# EAGLE design max78000_audio (EAGLE 9.6.2)
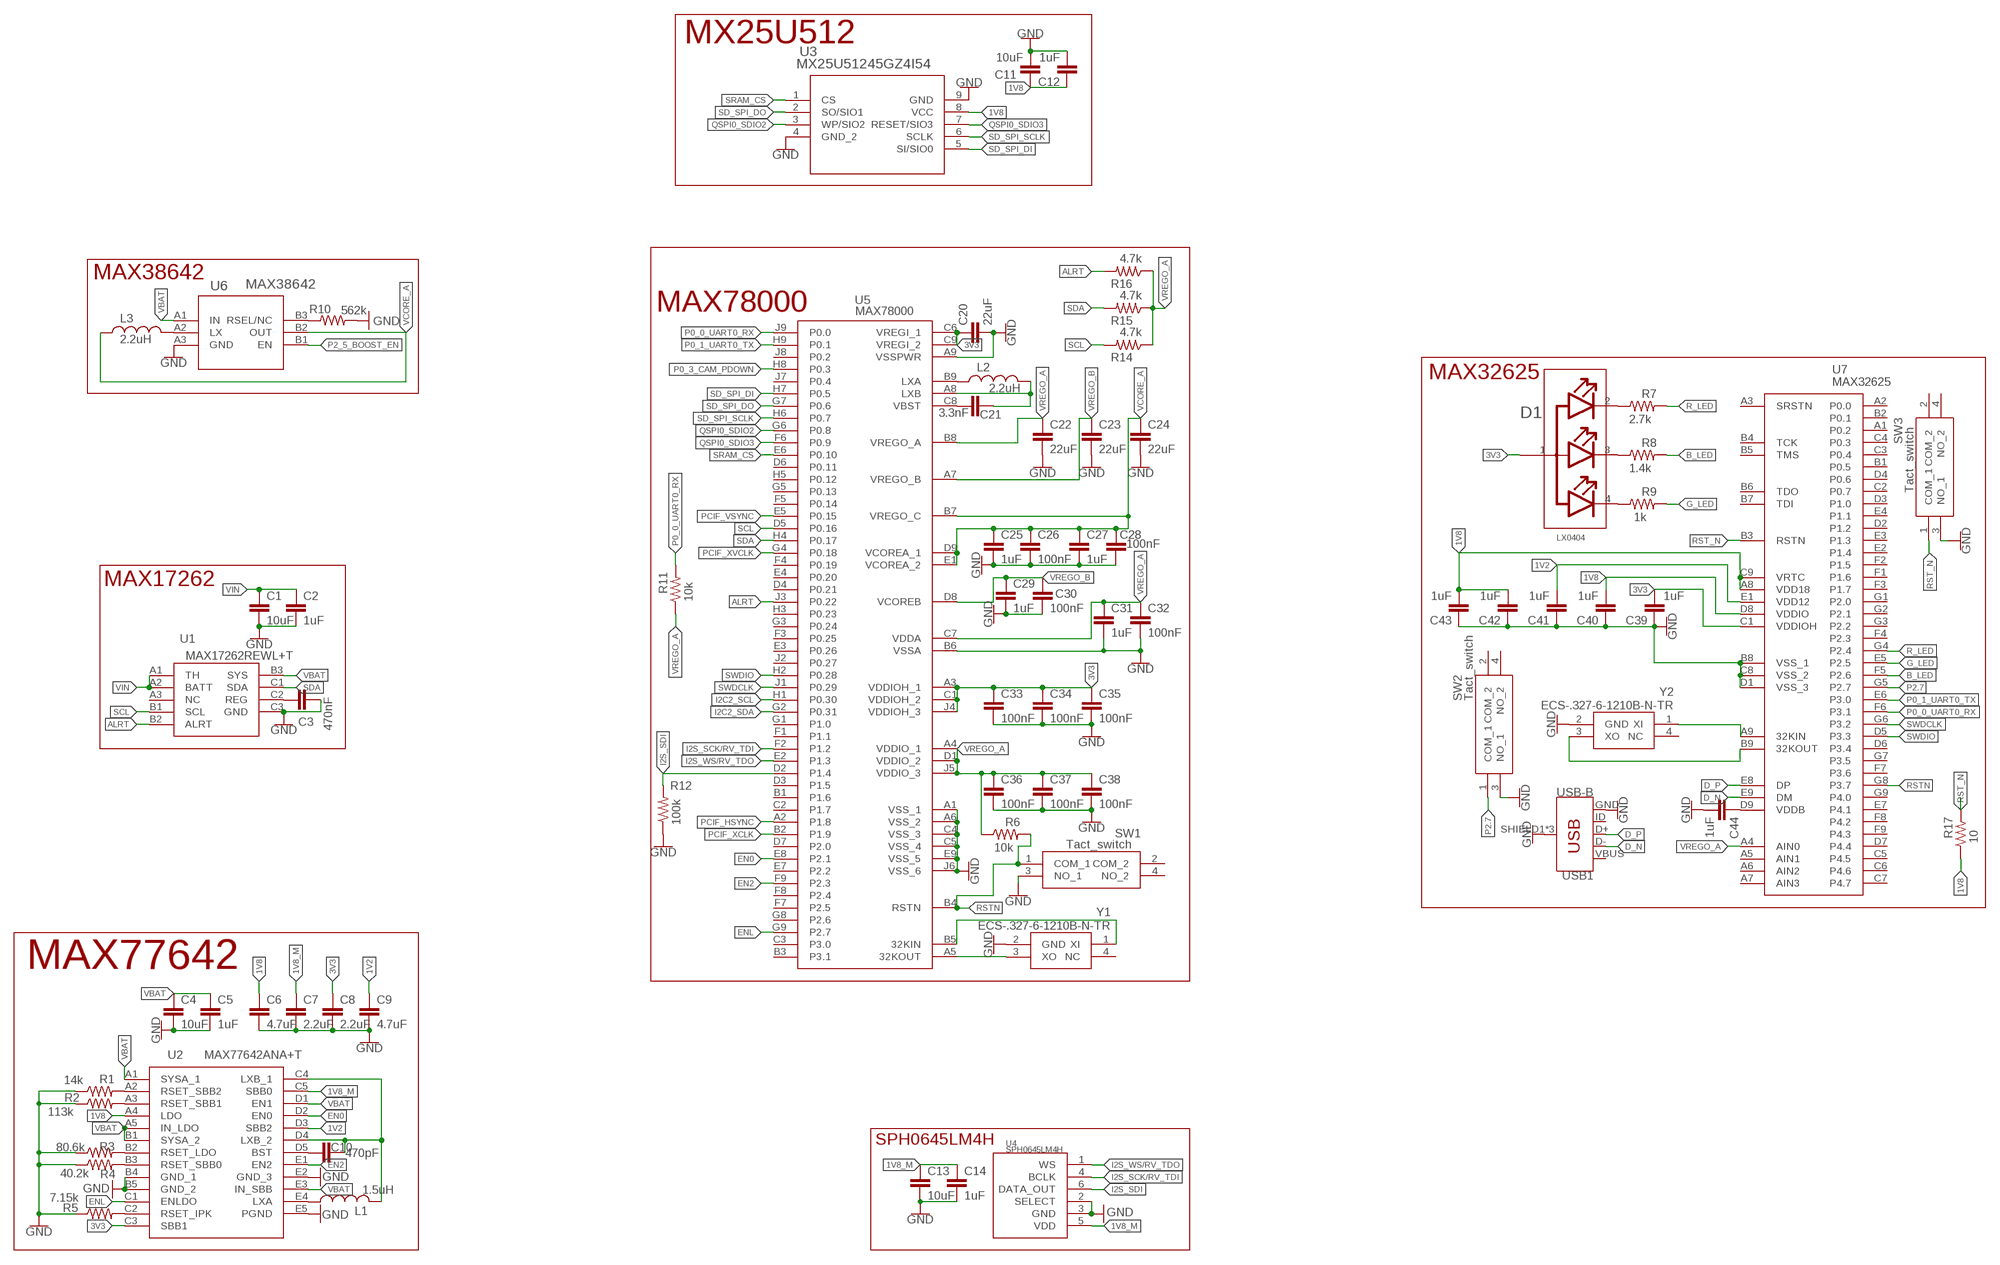
[diagram p0: schematic, sheet 1]

## Parts
C1  10uF  NPOL_SMD0402  [0402]
C2  1uF  NPOL_SMD0201  [0201]
C3  470nF  NPOL_SMD0201  [0201]
C4  10uF  NPOL_SMD0402  [0402]
C5  1uF  NPOL_SMD0201  [0201]
C6  4.7uF  NPOL_SMD0402  [0402]
C7  2.2uF  NPOL_SMD0402  [0402]
C8  2.2uF  NPOL_SMD0402  [0402]
C9  4.7uF  NPOL_SMD0402  [0402]
C10  470pF  NPOL_SMD0402  [0402]
C11  10uF  NPOL_SMD0201  [0201]
C12  1uF  NPOL_SMD0402  [0402]
C13  10uF  NPOL_SMD0402  [0402]
C14  1uF  NPOL_SMD0201  [0201]
C20  22uF  NPOL_SMD0603  [0603]
C21  3.3nF  NPOL_SMD0201  [0201]
C22  22uF  NPOL_SMD0603  [0603]
C23  22uF  NPOL_SMD0603  [0603]
C24  22uF  NPOL_SMD0603  [0603]
C25  1uF  NPOL_SMD0402  [0402]
C26  100nF  NPOL_SMD0201  [0201]
C27  1uF  NPOL_SMD0402  [0402]
C28  100nF  NPOL_SMD0201  [0201]
C29  1uF  NPOL_SMD0402  [0402]
C30  100nF  NPOL_SMD0201  [0201]
C31  1uF  NPOL_SMD0402  [0402]
C32  100nF  NPOL_SMD0201  [0201]
C33  100nF  NPOL_SMD0201  [0201]
C34  100nF  NPOL_SMD0201  [0201]
C35  100nF  NPOL_SMD0201  [0201]
C36  100nF  NPOL_SMD0201  [0201]
C37  100nF  NPOL_SMD0201  [0201]
C38  100nF  NPOL_SMD0201  [0201]
C39  1uF  NPOL_SMD0201  [0201]
C40  1uF  NPOL_SMD0201  [0201]
C41  1uF  NPOL_SMD0201  [0201]
C42  1uF  NPOL_SMD0201  [0201]
C43  1uF  NPOL_SMD0201  [0201]
C44  1uF  NPOL_SMD0201  [0201]
D1  LX0404  LUMEX_SML-LX0404SIUPGUSBLUMEX_SML-LX0404SIUPGUSB_0_0  [LUMEX_SML-LX0404SIUPGUSB_0]
L1  1.5uH  SMD0504  [0504]
L2  2.2uH  SMD0805  [0805]
L3  2.2uH  SMD0805  [0805]
R1  14k  SMD0201  [0201]
R2  113k  SMD0201  [0201]
R3  80.6k  SMD0201  [0201]
R4  40.2k  SMD0201  [0201]
R5  7.15k  SMD0201  [0201]
R6  10k  SMD0201  [0201]
R7  2.7k  SMD0201  [0201]
R8  1.4k  SMD0201  [0201]
R9  1k  SMD0201  [0201]
R10  562k  SMD0201  [0201]
R11  10k  SMD0201  [0201]
R12  100k  SMD0201  [0201]
R14  4.7k  SMD0201  [0201]
R15  4.7k  SMD0201  [0201]
R16  4.7k  SMD0201  [0201]
R17  10  SMD0201  [0201]
SW1  Tact_switch  PTS815_SJM_250_SMTR_LFS  [PTS815SJM250SMTRLFS]
SW2  Tact_switch  PTS815_SJM_250_SMTR_LFS  [PTS815SJM250SMTRLFS]
SW3  Tact_switch  PTS815_SJM_250_SMTR_LFS  [PTS815SJM250SMTRLFS]
U1  MAX17262REWL+T  [BGA9C40P3X3_147X145X69]
U2  MAX77642ANA+T  [BGA25C40P5X5_206X206X50]
U3  MX25U51245GZ4I54  MX25U51245GZ4I00  [WSON8_8X6XOP8_MAC]
U4  SPH0645LM4H  KNOWLES_SPH0645LM4H-BKNOWLES_SPH0645LM4H-B_0_0  [KNOWLES_SPH0645LM4H-B_0]
U5  MAX78000  MAX78000EXG+  [BGA81C80P9X9_800X800X130]
U6  MAX38642  MAX38642AENT+  [21-100128A_N60E1+2_MXM]
U7  MAX32625  MAX32625IWY+T  [BGA63C40P9X7_387X307X69]
USB1  USB-B  USB_MICRO-B_FEMALE-SMT  [USB-B-MICRO-SMD]
Y1  ECS-.327-6-1210B-N-TR  [ECS32761210BNTR]
Y2  ECS-.327-6-1210B-N-TR  [ECS32761210BNTR]

## Nets
1V2: C9.1 C41.2 U2.D3(SBB2) U7.E1(VDD12)
1V8: C6.1 C11.1 C12.1 C40.2 C42.2 C43.2 R17.1 U2.A4(LDO) U3.8(VCC) U7.A8(VDD18) U7.C9(VRTC) U7.D8(VDDIO)
1V8_M: C7.1 C13.1 C14.1 U2.C5(SBB0) U4.5(VDD)
3V3: C8.1 C20.1 C33.1 C34.1 C35.1 C39.2 D1.1(COMMON_ANODE) U2.C3(SBB1) U5.A3(VDDIOH_1) U5.C1(VDDIOH_2) U5.C6(VREGI_1) U5.C9(VREGI_2) U5.J4(VDDIOH_3) U7.C1(VDDIOH)
ALRT: R16.2 U1.B2(ALRT) U5.J3(P0.22)
B_LED: R8.2 U7.F5(P2.6)
D_N: U7.E9(DM) USB1.D-
D_P: U7.E8(DP) USB1.D+
EN0: U2.D2(EN0) U5.E8(P2.1)
EN2: U2.E1(EN2) U5.F9(P2.3)
ENL: U2.C1(ENLDO) U5.G9(P2.7)
G_LED: R9.2 U7.E5(P2.5)
GND: C1.2 C2.2 C3.2 C4.2 C5.2 C6.2 C7.2 C8.2 C9.2 C11.2 C12.2 C13.2 C14.2 C20.2 C22.2 C23.2 C24.2 C25.2 C26.2 C27.2 C28.2 C29.2 C30.2 C31.2 C32.2 C33.2 C34.2 C35.2 C36.2 C37.2 C38.2 C39.1 C40.1 C41.1 C42.1 C43.1 C44.2 R1.1 R2.1 R3.1 R4.1 R5.1 R10.2 R12.1 SW1.3(NO_1) SW2.3(NO_1) SW3.3(NO_1) U1.C3(GND) U2.B4(GND_1) U2.B5(GND_2) U2.E2(GND_3) U2.E5(PGND) U3.4(GND_2) U3.9(GND) U4.2(SELECT) U4.3(GND) U5.A1(VSS_1) U5.A6(VSS_2) U5.A9(VSSPWR) U5.B6(VSSA) U5.C4(VSS_3) U5.C5(VSS_4) U5.E9(VSS_5) U5.J6(VSS_6) U6.A3(GND) U7.B8(VSS_1) U7.C8(VSS_2) U7.D1(VSS_3) USB1.GND USB1.SHIELD1(SHIELD) USB1.SHIELD2(SHIELD) USB1.SHIELD3(SHIELD) Y1.2(GND) Y2.2(GND)
I2C2_SCL: U5.H1(P0.30)
I2C2_SDA: U5.G2(P0.31)
I2S_SCK/RV_TDI: U4.4(BCLK) U5.F2(P1.2)
I2S_SDI: R12.2 U4.6(DATA_OUT) U5.D2(P1.4)
I2S_WS/RV_TDO: U4.1(WS) U5.E2(P1.3)
N$1: C21.2 L2.2 U5.A8(LXB)
N$2: R3.2 U2.B2(RSET_LDO)
N$3: R4.2 U2.B3(RSET_SBB0)
N$4: R5.2 U2.C2(RSET_IPK)
N$5: R1.2 U2.A2(RSET_SBB2)
N$6: R2.2 U2.A3(RSET_SBB1)
N$7: C10.1 U2.D5(BST)
N$8: L1.1 U2.E4(LXA)
N$9: C21.1 U5.C8(VBST)
N$10: U5.A5(32KOUT) Y1.3(XO)
N$11: U5.B5(32KIN) Y1.1(XI)
N$12: C3.1 U1.C2(REG)
N$13: L2.1 U5.B9(LXA)
N$14: U7.A9(32KIN) Y2.1(XI)
N$15: U7.B9(32KOUT) Y2.3(XO)
N$16: C44.1 U7.D9(VDDB)
N$17: D1.2(RED_CATHODE) R7.1
N$18: D1.3(BLUE_CATHODE) R8.1
N$19: D1.4(GREEN_CATHODE) R9.1
N$20: L3.2 U6.A2(LX)
N$22: R10.1 U6.B3(RSEL/NC)
N$31: C10.2 L1.2 U2.C4(LXB_1) U2.D4(LXB_2)
P0_0_UART0_RX: R11.2 U5.J9(P0.0) U7.F6(P3.1)
P0_1_UART0_TX: U5.H9(P0.1) U7.E6(P3.0)
P0_3_CAM_PDOWN: U5.H8(P0.3)
P2.7: SW2.1(COM_1) U7.G5(P2.7)
P2_5_BOOST_EN: U6.B1(EN)
PCIF_HSYNC: U5.A2(P1.8)
PCIF_VSYNC: U5.E5(P0.15)
PCIF_XCLK: U5.B2(P1.9)
PCIF_XVCLK: U5.G4(P0.18)
QSPI0_SDIO2: U3.3(WP/SIO2) U5.G6(P0.8)
QSPI0_SDIO3: U3.7(RESET/SIO3) U5.F6(P0.9)
R_LED: R7.2 U7.G4(P2.4)
RST_N: R17.2 SW3.1(COM_1) U7.B3(RSTN)
RSTN: R6.2 SW1.1(COM_1) U5.B4(RSTN) U7.G8(P3.7)
SCL: R14.2 U1.B1(SCL) U5.D5(P0.16)
SD_SPI_DI: U3.5(SI/SIO0) U5.H7(P0.5)
SD_SPI_DO: U3.2(SO/SIO1) U5.G7(P0.6)
SD_SPI_SCLK: U3.6(SCLK) U5.H6(P0.7)
SDA: R15.2 U1.C1(SDA) U5.H4(P0.17)
SRAM_CS: U3.1(CS) U5.E6(P0.10)
SWDCLK: U5.J1(P0.29) U7.G6(P3.2)
SWDIO: U5.H2(P0.28) U7.D5(P3.3)
VBAT: C4.1 C5.1 U1.B3(SYS) U2.A1(SYSA_1) U2.A5(IN_LDO) U2.B1(SYSA_2) U2.D1(EN1) U2.E3(IN_SBB) U6.A1(IN)
VCORE_A: C24.1 C25.1 C26.1 C27.1 C28.1 L3.1 U5.B7(VREGO_C) U5.D9(VCOREA_1) U5.E1(VCOREA_2) U6.B2(OUT)
VIN: C1.1 C2.1 U1.A1(TH) U1.A2(BATT)
VREGO_A: C22.1 C31.1 C32.1 C36.1 C37.1 C38.1 R6.1 R11.1 R14.1 R15.1 R16.1 U5.A4(VDDIO_1) U5.B8(VREGO_A) U5.C7(VDDA) U5.D1(VDDIO_2) U5.J5(VDDIO_3) U7.A4(AIN0)
VREGO_B: C23.1 C29.1 C30.1 U5.A7(VREGO_B) U5.D8(VCOREB)
Unconnected: SW1.2(COM_2) SW1.4(NO_2) SW2.2(COM_2) SW2.4(NO_2) SW3.2(COM_2) SW3.4(NO_2) U1.A3(NC) U5.B1(P1.6) U5.B3(P3.1) U5.C2(P1.7) U5.C3(P3.0) U5.D3(P1.5) U5.D4(P0.21) U5.D6(P0.11) U5.D7(P2.0) U5.E3(P0.26) U5.E4(P0.20) U5.E7(P2.2) U5.F1(P1.1) U5.F3(P0.25) U5.F4(P0.19) U5.F5(P0.14) U5.F7(P2.5) U5.F8(P2.4) U5.G1(P1.0) U5.G3(P0.24) U5.G5(P0.13) U5.G8(P2.6) U5.H3(P0.23) U5.H5(P0.12) U5.J2(P0.27) U5.J7(P0.4) U5.J8(P0.2) U7.A1(P0.2) U7.A2(P0.0) U7.A3(SRSTN) U7.A5(AIN1) U7.A6(AIN2) U7.A7(AIN3) U7.B1(P0.5) U7.B2(P0.1) U7.B4(TCK) U7.B5(TMS) U7.B6(TDO) U7.B7(TDI) U7.C2(P0.7) U7.C3(P0.4) U7.C4(P0.3) U7.C5(P4.5) U7.C6(P4.6) U7.C7(P4.7) U7.D2(P1.2) U7.D3(P1.0) U7.D4(P0.6) U7.D6(P3.4) U7.D7(P4.4) U7.E2(P1.4) U7.E3(P1.3) U7.E4(P1.1) U7.E7(P4.1) U7.F1(P1.6) U7.F2(P1.5) U7.F3(P1.7) U7.F4(P2.3) U7.F7(P3.6) U7.F8(P4.2) U7.F9(P4.3) U7.G1(P2.0) U7.G2(P2.1) U7.G3(P2.2) U7.G7(P3.5) U7.G9(P4.0) USB1.ID Y1.4(NC) Y2.4(NC)

## Notes on the sheet
- MX25U512
- MAX38642
- MAX78000
- MAX32625
- MAX17262
- MAX77642
- SPH0645LM4H

## Power pins joined to a net without a drawn wire
VBUS: USB1.VBUS

## Library data of the parts
C1-C14 C20-C44 = Sensio-Capacitors:NPOL_SMD: Generic non-polarized capacitor packages; VALUE: 1
D1 = Sensio-Diodes:LUMEX_SML-LX0404SIUPGUSB: Red, Green, Blue (RGB) LED Indication - Discrete 1.95V Red, 2.85V Green, 2.73V Blue 0404 (1010 Metric); AUTOMOTIVE: No; CENTROID_NOT_SPECIFIED: No; COLOUR: Red, Green, Blue; DATASHEET: https://www.lumex.com/datasheet/SML-LX0404SIUPGUSB.html; DEVICE_CLASS_L1: Optoelectronics; DEVICE_CLASS_L2: LEDs; DEVICE_CLASS_L3: unset; DIGIKEY_DESCRIPTION: LED RGB CLEAR SMD; DIGIKEY_PART_NUMBER: 67-2125-1-ND; FOOTPRINT_VARIANT_NAME_0: Recommended_Land_Pattern; FORWARD_CURRENT: 2mA; FORWARD_VOLTAGE: 1.95/2.75/2.7V; HEIGHT: 0.25mm; LEAD_FREE: Yes; LED_ORIENTATION: Top View; LUMINOUS_INTENSITY: 35/50/20mcd; MF: Lumex; MFG_PACKAGE_IDENT: 0; MFG_PACKAGE_IDENT_DATE: 0; MFG_PACKAGE_IDENT_REV: 0; MOUSER_DESCRIPTION: Red/Green/Blue 0404 120° Water Clear 30/40/20 mcd PCB Surface Mount LED; MOUSER_PART_NUMBER: 696-LX0404SIUPGUSB; MPN: SML-LX0404SIUPGUSB; PACKAGE: 0404; PEAK_EMMISION_WAVELENGTH: 632/518/468nm; POWER_DISSIPATION: 60/95/30mW; PREFIX: D; REVERSE_VOLTAGE: 5V; ROHS: Yes; TEMPERATURE_RANGE_HIGH: +85°C; TEMPERATURE_RANGE_LOW: -40°C; VERIFICATION_VERSION: 0.0.0.3; VIEWING_ANGLE: 120°; WAVELENGTH: 627/531/470nm
L1-L3 = Sensio-Inductors:SMD: Generic inductor packages; VALUE: 1
R1-R12 R14-R17 = Sensio-Resistors:SMD: Generic resistor packages; VALUE: 1
SW1-SW3 = Sensio-Switches:PTS815_SJM_250_SMTR_LFS: Tactile Switches DC Voltage rating: 12 V Current rating: 50 mA Dimension: 4.2 mm x 3.2 mm x 2.5 mm Mounting type: SMD Datasheet: PTS815_SJM_250_SMTR_LFS <https://www.ckswitches.com/media/2728/pts815.pdf> Order now: PTS815_SJM_250_SMTR_LFS <https://www.mouser.in/ProductDetail/CK/PTS815-SJM-250-SMTR-LFS?qs=ahcBuItHZ3xKWmfV%2F2E6bA%3D%3D>
U1 = Sensio-PMICs:MAX17262REWL+T: Battery Management 5.2 A 1-Cell Fuel Gauge with ModelGauge m5 EZ and Internal CurrentSensing Source: Datasheet <https://datasheets.maximintegrated.com/en/ds/MAX17262.pdf>; DESCRIPTION: Battery Management 5.2 A 1-Cell Fuel Gauge with ModelGauge m5 EZ and Internal CurrentSensing; HEIGHT: 0.69mm; MANUFACTURER_NAME: Maxim Integrated; MANUFACTURER_PART_NUMBER: MAX17262REWL+T; MOUSER_PART_NUMBER: 700-MAX17262REWL+T; MOUSER_PRICE-STOCK: https://www.mouser.co.uk/ProductDetail/Maxim-Integrated/MAX17262REWL%2bT/?qs=byeeYqUIh0N%2Fwt%2FPHEGinQ%3D%3D
U2 = Sensio-PMICs:MAX77642ANA+T: Ultra Configurable PMIC Featuring 93% Peak Efficiency Single-Inductor, 3-Output BuckBoost, 1-LDO for Long Battery Life, 25 WLP Source: Datasheet <https://datasheets.maximintegrated.com/en/ds/MAX77642-MAX77643.pdf>; DESCRIPTION: Ultra Configurable PMIC Featuring 93% Peak Efficiency Single-Inductor, 3-Output BuckBoost, 1-LDO for Long Battery Life, 25 WLP; HEIGHT: 0.5mm; MANUFACTURER_NAME: Maxim Integrated; MANUFACTURER_PART_NUMBER: MAX77642ANA+T
U3 = Sensio-Memory:MX25U51245GZ4I00; BUILT_BY: EMA_Cory; COPYRIGHT: Copyright (C) 2018 Accelerated Designs. All rights reserved; DATASHEET: https://4donline.ihs.com/images/VipMasterIC/IC/MXMA/MXMA-S-A0010189702/MXMA-S-A0010189702-1.pdf?hkey=52A5661711E402568146F3353EA87419; MANUFACTURER_PART_NUMBER: MX25U51245GZ4I00; SOURCELIBRARY: Macronix_2020-10-05; VENDOR: Macronix
U4 = Sensio-Mic:KNOWLES_SPH0645LM4H-B: 20Hz ~ 10kHz Digital, I²S Microphone MEMS (Silicon) 1.62V ~ 3.6V Omnidirectional (-26dB ±3dB @ 94dB SPL) Solder Pads; AUTOMOTIVE: No; CAPACITANCE: 120pF; CENTROID_NOT_SPECIFIED: No; CURRENT: 600uA; DATASHEET: https://www.knowles.com/docs/default-source/model-downloads/sph0645lm4h-b-datasheet-rev-c.pdf?Status=Master&sfvrsn=c1bf77b1_4; DEVICE_CLASS_L1: Electromechanical; DEVICE_CLASS_L2: Audio Products; DEVICE_CLASS_L3: Microphones; DIGIKEY_DESCRIPTION: MICROPHONE MEMS DIGITAL I2S OMNI; DIGIKEY_PART_NUMBER: 423-1405-1-ND; DIRECTION: Omidirectional; FOOTPRINT_VARIANT_NAME_0: Recommended_Land_Pattern; FREQUENCY: 3072kHz; HEIGHT: 1.08mm; LEAD_FREE: Yes; MAX_SUPPLY_VOLTAGE: 3.6V; MF: Knowles; MFG_PACKAGE_IDENT: 0; MFG_PACKAGE_IDENT_DATE: 0; MFG_PACKAGE_IDENT_REV: 0; MIN_SUPPLY_VOLTAGE: 1.62V; MOUSER_PART_NUMBER: 721-SPH0645LM4H-B; MPN: SPH0645LM4H-B; OCTOPART_PART_NUMBER: SPH0645LM4H-B; OPERATING_SUPPLY_VOLTAGE: 1.8V; PACKAGE: SMT_3MM50_2MM65; PIN_0_0_1_INSIDE_EDGE: clock; PREFIX: U; ROHS: Yes; TEMPERATURE_RANGE_HIGH: +45°C; TEMPERATURE_RANGE_LOW: 0°C; VERIFICATION_VERSION: 0.0.0.3; VOLTAGE: 3.6V
U5 = Sensio-MCU_MPU:MAX78000EXG+: ARM Microcontrollers - MCU ARM M4F w/ 432KB Weight CNN Accelerator, CTBGA Source: Datasheet <https://pdfserv.maximintegrated.com/en/ds/MAX78000.pdf>; DESCRIPTION: ARM Microcontrollers - MCU ARM M4F w/ 432KB Weight CNN Accelerator, CTBGA; HEIGHT: 1.3mm; MANUFACTURER_NAME: Maxim Integrated; MANUFACTURER_PART_NUMBER: MAX78000EXG+; MOUSER_PART_NUMBER: 700-MAX78000EXG+; MOUSER_PRICE-STOCK: https://www.mouser.co.uk/ProductDetail/Maxim-Integrated/MAX78000EXG%2b/?qs=yqaQSyyJnNigS5t%2FKz0nhQ%3D%3D
U6 = Sensio-PMICs:MAX38642AENT+; BUILT_BY: EMA_Jessica; COPYRIGHT: Copyright (C) 2018 Accelerated Designs. All rights reserved; MANUFACTURER_PART_NUMBER: MAX38642AENT+; SOURCELIBRARY: Maxim_2019-09-23; VENDOR: Maxim Integrated Products
U7 = Sensio-MCU_MPU:MAX32625IWY+T: ARM Microcontrollers - MCU ENTERPRISE ARM M4 32 BIT MICRO WLP Source: Datasheet <https://pdfserv.maximintegrated.com/en/ds/MAX32625-MAX32626.pdf>; DESCRIPTION: ARM Microcontrollers - MCU ENTERPRISE ARM M4 32 BIT MICRO WLP; HEIGHT: 0.69mm; MANUFACTURER_NAME: Maxim Integrated; MANUFACTURER_PART_NUMBER: MAX32625IWY+T; MOUSER_PART_NUMBER: 700-MAX32625IWY+T; MOUSER_PRICE-STOCK: https://www.mouser.co.uk/ProductDetail/Maxim-Integrated/MAX32625IWY%2bT?qs=L1HKySJ92145VOe79DoIUw%3D%3D
USB1 = Sensio-USB:USB_MICRO-B: Female USB Type Micro-B Connector
Y1 Y2 = Sensio-Oscillators:ECS-.327-6-1210B-N-TR: Crystals CRYSTAL 32.768KHZ 6PF , ECX-1210B, kHz Crystal (Tuning Fork), 32.768kHz, +/- 20ppm, 80 kOhms, Fundamental, -40 C ~ 85 C, Surface Mount, 4-SMD, No Lead, 0.047" L x 0.039" W (1.20mm x 1.00mm), 0.014" (0.35mm) Source: Datasheet <https://www.mouser.de/datasheet/2/122/ECX-1210B-1730535.pdf>; DESCRIPTION: Crystals CRYSTAL 32.768KHZ 6PF , ECX-1210B, kHz Crystal (Tuning Fork), 32.768kHz, +/- 20ppm, 80 kOhms, Fundamental, -40 C ~ 85 C, Surface Mount, 4-SMD, No Lead, 0.047" L x 0.039" W (1.20mm x 1.00mm), 0.014" (0.35mm); HEIGHT: 0.35mm; MANUFACTURER_NAME: ECS; MANUFACTURER_PART_NUMBER: ECS-.327-6-1210B-N-TR; MOUSER_PART_NUMBER: 520-ECS32761210BNTR; MOUSER_PRICE-STOCK: https://www.mouser.co.uk/ProductDetail/ECS/ECS-327-6-1210B-N-TR?qs=GBLSl2AkirtSboxiTIkhbA%3D%3D

## Board
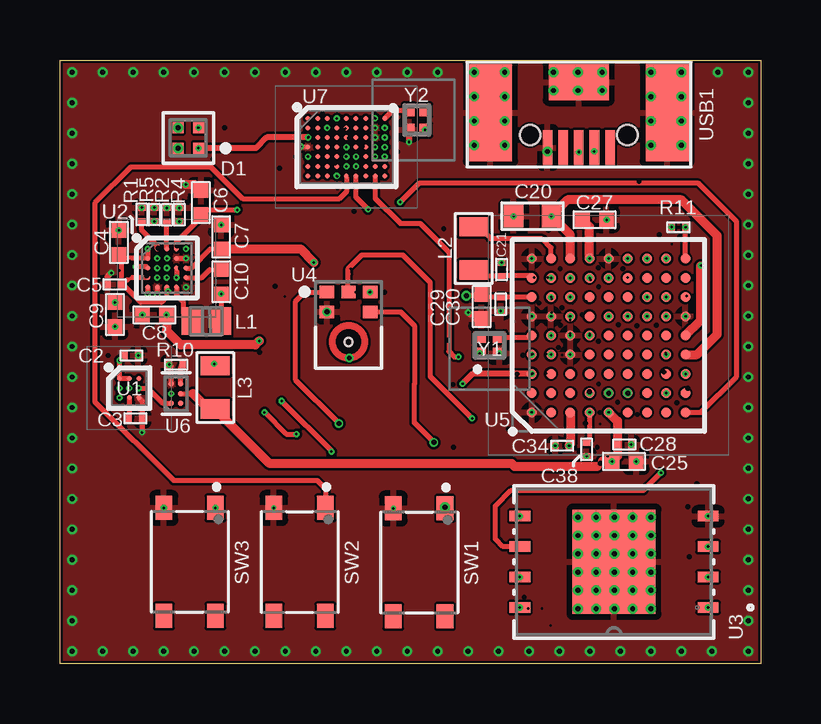
[diagram p1: board, top side]
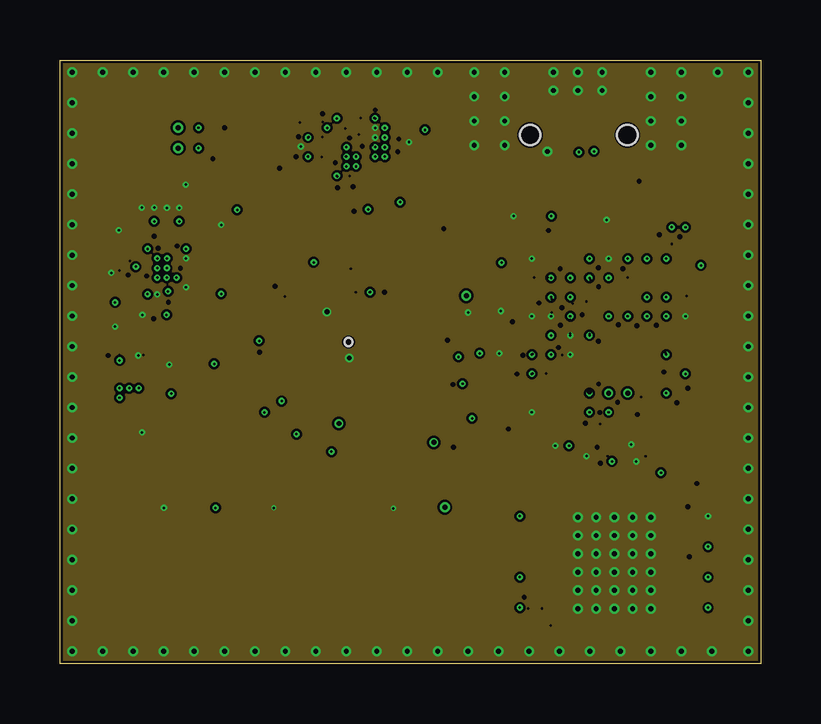
[diagram p2: board, inner layer Route2]
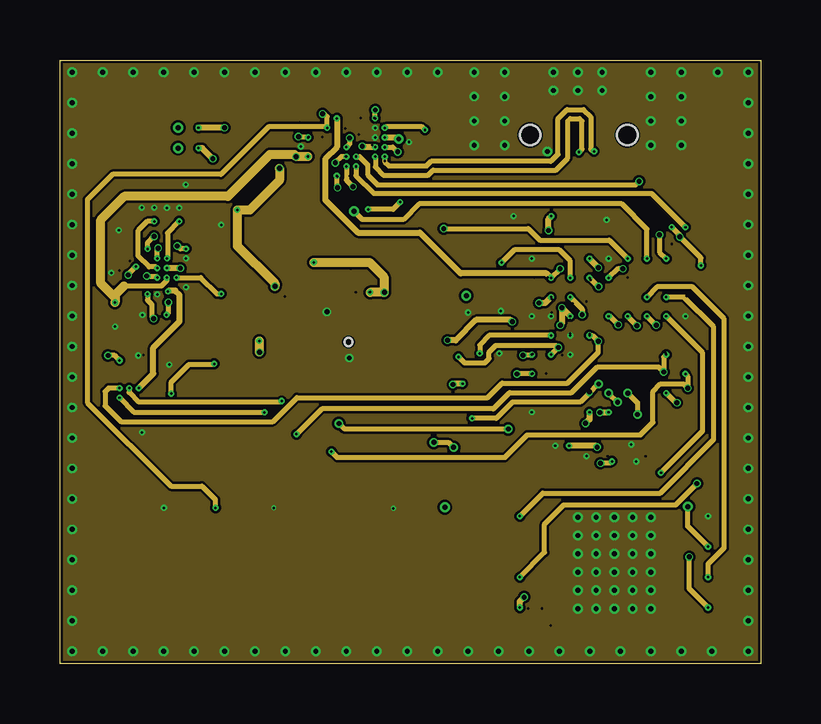
[diagram p3: board, inner layer Route3]
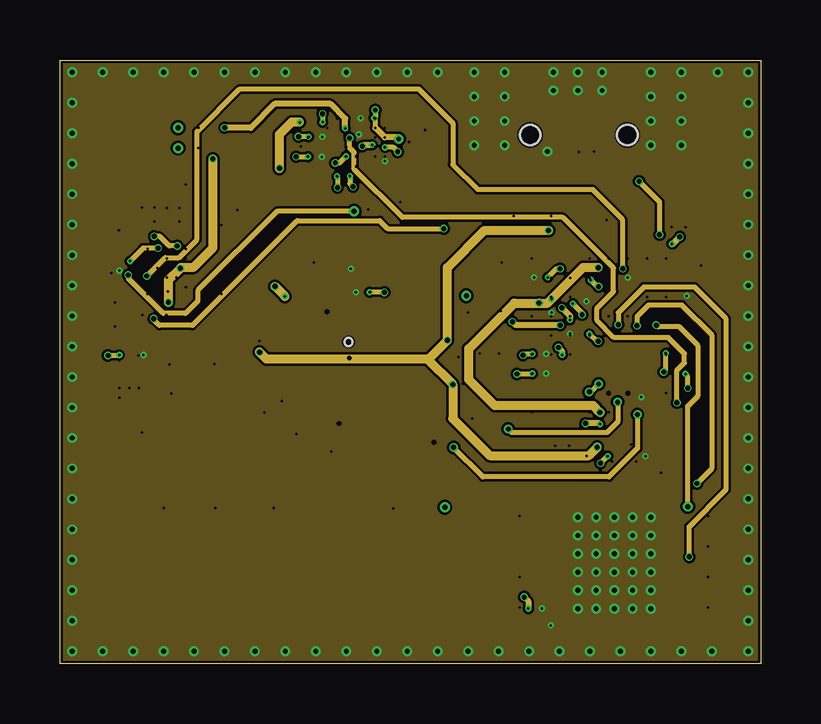
[diagram p4: board, inner layer Route14]
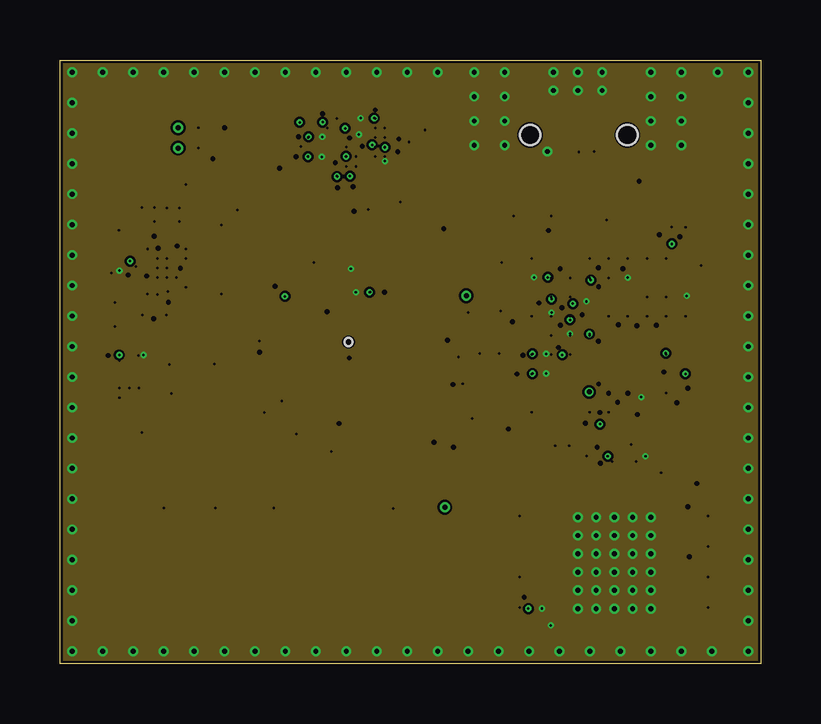
[diagram p5: board, inner layer Route15]
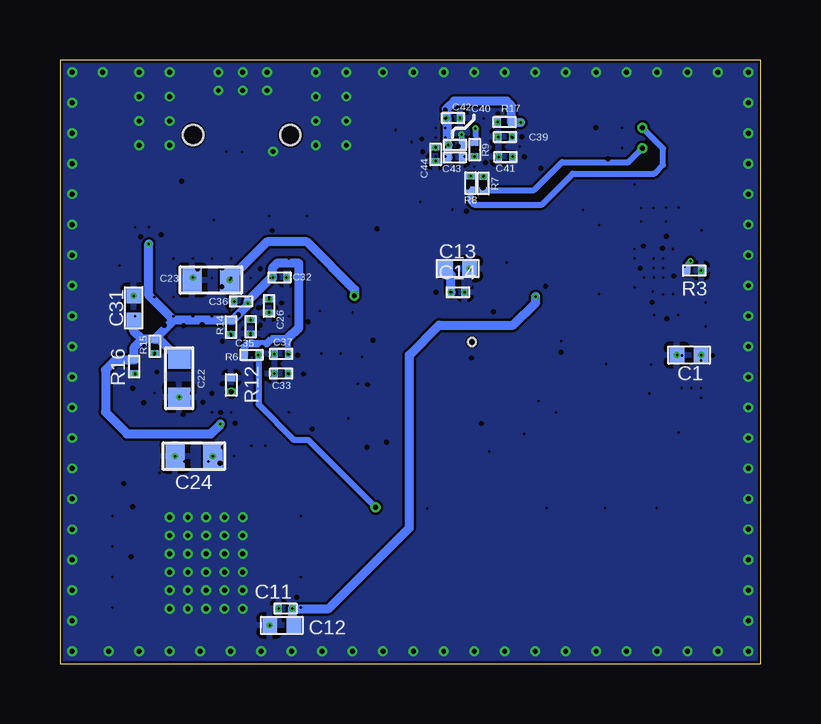
[diagram p6: board, bottom side, seen from below]

Size 29.21 x 25.15 mm. Coordinates in mm from the lower left corner, seen from the top.
Outline: 29.21,25.15 29.21,0 0,0 0,25.15 29.21,25.15
Copper layers ([3:1+2*(3+14)*15+16:14]): Top 0.044959375mm / dielectric 0.07111875mm / Route2 0.029971875mm / dielectric 8mil / Route3 0.029971875mm / dielectric 2mil / Route14 0.029971875mm / dielectric 8mil / Route15 0.029971875mm / dielectric 0.07111875mm / Bottom 0.044959375mm
Design rules "default *": minimum track width 8mil, minimum drill 4mil, track to track 4mil, track to pad 4mil, pad to pad 4mil, via to via 4mil, smd to smd 4mil, copper to edge 4mil, drill to drill 6mil, minimum pad ring 10mil, minimum via ring 2mil, stop-mask expansion 4mil, vias tented up to drill 0mil, thermal gap 10mil

### Footprints (pad centres in the part's own frame; a part is rotated, then mirrored left to right if it is on the bottom)
0402 = smd 0.61 x 0.61: 1 -0.504,0; 2 0.504,0
0201 = smd 0.25 x 0.33: 1 -0.284,0; 2 0.284,0
0603 = smd 0.8 x 0.95: 1 -0.799,0; 2 0.774,0
LUMEX_SML-LX0404SIUPGUSB_0 = smd 0.45 x 0.45: 1 -0.425,0.425; 2 0.425,0.425; 3 0.425,-0.425; 4 -0.425,-0.425
0504 = smd 0.864 x 1.143: 1 -0.597,0; 2 0.597,0
0805 = smd 0.8 x 1.2: 1 -0.9,0; 2 0.9,0
PTS815SJM250SMTRLFS = smd 1 x 0.7: 1 -2.25,1.075; 2 2.25,1.075; 3 -2.25,-1.075; 4 2.25,-1.075
BGA9C40P3X3_147X145X69 = smd 0.216 x 0.216: A1 -0.4,0.4; A2 0,0.4; A3 0.4,0.4; B1 -0.4,0; B2 0,0; B3 0.4,0; C1 -0.4,-0.4; C2 0,-0.4; C3 0.4,-0.4
BGA25C40P5X5_206X206X50 = smd 0.216 x 0.216: A1 -0.8,0.8; A2 -0.4,0.8; A3 0,0.8; A4 0.4,0.8; A5 0.8,0.8; B1 -0.8,0.4; B2 -0.4,0.4; B3 0,0.4; B4 0.4,0.4; B5 0.8,0.4; C1 -0.8,0; C2 -0.4,0; C3 0,0; C4 0.4,0; C5 0.8,0; D1 -0.8,-0.4; D2 -0.4,-0.4; D3 0,-0.4; D4 0.4,-0.4; D5 0.8,-0.4; E1 -0.8,-0.8; E2 -0.4,-0.8; E3 0,-0.8; E4 0.4,-0.8; E5 0.8,-0.8
WSON8_8X6XOP8_MAC = smd 0.864 x 0.432: 1 -3.924,1.905; 2 -3.924,0.635; 3 -3.924,-0.635; 4 -3.924,-1.905; 5 3.924,-1.905; 6 3.924,-0.635; 7 3.924,0.635; 8 3.924,1.905 | smd 3.454 x 4.343: 9 0,0
KNOWLES_SPH0645LM4H-B_0 = smd 0.6 x 0.522: 1 -0.9,1.364; 2 -0.9,0.542; 4 0.9,0.542; 5 0.9,1.364; 6 0,1.364 | smd 0.259 x 0.259: 3 0.032,-1.377 | hole 0.325: 0,-0.71
BGA81C80P9X9_800X800X130 = smd 0.41 x 0.41: A1 -3.2,3.2; A2 -2.4,3.2; A3 -1.6,3.2; A4 -0.8,3.2; A5 0,3.2; A6 0.8,3.2; A7 1.6,3.2; A8 2.4,3.2; A9 3.2,3.2; B1 -3.2,2.4; B2 -2.4,2.4; B3 -1.6,2.4; B4 -0.8,2.4; B5 0,2.4; B6 0.8,2.4; B7 1.6,2.4; B8 2.4,2.4; B9 3.2,2.4; C1 -3.2,1.6; C2 -2.4,1.6; C3 -1.6,1.6; C4 -0.8,1.6; C5 0,1.6; C6 0.8,1.6; C7 1.6,1.6; C8 2.4,1.6; C9 3.2,1.6; D1 -3.2,0.8; D2 -2.4,0.8; D3 -1.6,0.8; D4 -0.8,0.8; D5 0,0.8; D6 0.8,0.8; D7 1.6,0.8; D8 2.4,0.8; D9 3.2,0.8; E1 -3.2,0; E2 -2.4,0; E3 -1.6,0; E4 -0.8,0; E5 0,0; E6 0.8,0; E7 1.6,0; E8 2.4,0; E9 3.2,0; F1 -3.2,-0.8; F2 -2.4,-0.8; F3 -1.6,-0.8; F4 -0.8,-0.8; F5 0,-0.8; F6 0.8,-0.8; F7 1.6,-0.8; F8 2.4,-0.8; F9 3.2,-0.8; G1 -3.2,-1.6; G2 -2.4,-1.6; G3 -1.6,-1.6; G4 -0.8,-1.6; G5 0,-1.6; G6 0.8,-1.6; G7 1.6,-1.6; G8 2.4,-1.6; G9 3.2,-1.6; H1 -3.2,-2.4; H2 -2.4,-2.4; H3 -1.6,-2.4; H4 -0.8,-2.4; H5 0,-2.4; H6 0.8,-2.4; H7 1.6,-2.4; H8 2.4,-2.4; H9 3.2,-2.4; J1 -3.2,-3.2; J2 -2.4,-3.2; J3 -1.6,-3.2; J4 -0.8,-3.2; J5 0,-3.2; J6 0.8,-3.2; J7 1.6,-3.2; J8 2.4,-3.2; J9 3.2,-3.2
21-100128A_N60E1+2_MXM = smd 0.229 x 0.229: A1 -0.4,0.2; A2 0,0.2; A3 0.4,0.2; B1 -0.4,-0.2; B2 0,-0.2; B3 0.4,-0.2
BGA63C40P9X7_387X307X69 = smd 0.216 x 0.216: A1 -1.6,1.2; A2 -1.2,1.2; A3 -0.8,1.2; A4 -0.4,1.2; A5 0,1.2; A6 0.4,1.2; A7 0.8,1.2; A8 1.2,1.2; A9 1.6,1.2; B1 -1.6,0.8; B2 -1.2,0.8; B3 -0.8,0.8; B4 -0.4,0.8; B5 0,0.8; B6 0.4,0.8; B7 0.8,0.8; B8 1.2,0.8; B9 1.6,0.8; C1 -1.6,0.4; C2 -1.2,0.4; C3 -0.8,0.4; C4 -0.4,0.4; C5 0,0.4; C6 0.4,0.4; C7 0.8,0.4; C8 1.2,0.4; C9 1.6,0.4; D1 -1.6,0; D2 -1.2,0; D3 -0.8,0; D4 -0.4,0; D5 0,0; D6 0.4,0; D7 0.8,0; D8 1.2,0; D9 1.6,0; E1 -1.6,-0.4; E2 -1.2,-0.4; E3 -0.8,-0.4; E4 -0.4,-0.4; E5 0,-0.4; E6 0.4,-0.4; E7 0.8,-0.4; E8 1.2,-0.4; E9 1.6,-0.4; F1 -1.6,-0.8; F2 -1.2,-0.8; F3 -0.8,-0.8; F4 -0.4,-0.8; F5 0,-0.8; F6 0.4,-0.8; F7 0.8,-0.8; F8 1.2,-0.8; F9 1.6,-0.8; G1 -1.6,-1.2; G2 -1.2,-1.2; G3 -0.8,-1.2; G4 -0.4,-1.2; G5 0,-1.2; G6 0.4,-1.2; G7 0.8,-1.2; G8 1.2,-1.2; G9 1.6,-1.2
USB-B-MICRO-SMD = smd 1.45 x 0.4: D+ 2.725,0; D- 2.725,0.65; GND 2.725,-1.3; ID 2.725,-0.65; VBUS 2.725,1.3 | smd 4.04 x 1.8: SHIELD1 1.27,3.685; SHIELD2 1.27,-3.685 | smd 1.5 x 2.5: SHIELD3 0,0 | hole 0.85: 2.2,2.027; 2.2,-2.027
ECS32761210BNTR = smd 0.52 x 0.47: 1 -0.41,-0.335; 2 0.41,-0.335; 3 0.41,0.335; 4 -0.41,0.335

### Placement (x,y rotation side)
C1  2.98,12.85 180 bottom
C2  2.98,12.83 0 top
C3  3.15,10.22 0 top
C4  2.46,17.55 90 top
C5  2.28,15.8 180 top
C6  5.88,19.21 90 top
C7  6.72,17.78 90 top
C8  3.94,14.53 180 top
C9  2.29,14.54 270 top
C10  6.73,15.91 270 top
C11  19.81,2.29 180 bottom
C12  19.96,1.59 180 bottom
C13  12.63,16.45 0 bottom
C14  12.62,15.47 0 bottom
C20  19.69,18.64 180 top
C21  18.41,16.42 270 top
C22  24.23,11.87 270 bottom
C23  22.93,15.98 180 bottom
C24  23.63,8.64 180 bottom
C25  23.52,8.42 0 top
C26  20.49,14.9 270 bottom
C27  22.29,18.49 0 top
C28  23.53,9.12 0 top
C29  17.58,14.87 270 top
C30  18.38,14.97 270 top
C31  26.13,14.82 90 bottom
C32  20.05,16.09 0 bottom
C33  19.99,12.08 180 bottom
C34  20.94,9.07 180 top
C35  21.26,14.03 270 bottom
C36  21.66,15.09 180 bottom
C37  19.99,12.9 180 bottom
C38  21.95,8.92 270 top
C39  10.65,21.94 0 bottom
C40  12.74,21.61 180 bottom
C41  10.63,21.11 0 bottom
C42  12.82,22.72 180 bottom
C43  12.74,21.09 180 bottom
C44  13.55,21.22 270 bottom
D1  5.35,21.9 180 top
L1  6.1,14.27 0 top
L2  17.25,17.29 270 top
L3  6.47,11.5 90 top
R1  3.41,18.71 270 top
R2  4.46,18.7 270 top
R3  2.76,16.37 180 bottom
R4  4.97,18.7 270 top
R5  3.93,18.71 270 top
R6  21.22,12.86 0 bottom
R7  11.56,20.01 90 bottom
R8  12.09,20.02 90 bottom
R9  11.92,21.41 270 bottom
R10  4.84,12.45 180 top
R11  25.79,18.18 0 top
R12  22.07,11.6 270 bottom
R14  22.08,14.01 270 bottom
R15  25.26,13.22 270 bottom
R16  26.12,12.37 270 bottom
R17  10.67,22.56 180 bottom
SW1  14.97,4.21 270 top
SW2  9.99,4.23 270 top
SW3  5.41,4.24 270 top
U1  2.89,11.47 0 top
U2  4.46,16.48 0 top
U3  23.1,4.24 180 top
U4  12.03,14.11 0 top
U5  22.87,13.67 90 top
U6  4.84,11.25 90 top
U7  11.94,21.52 0 top
USB1  21.63,24.22 270 top
Y1  17.91,13.26 0 top
Y2  14.88,22.65 270 top

### Tracks (layer width: path | path; a pad name or v marks a point on that pad's centre or on a via)
1V2  (via drill 0.1 pad 0.25 layers 1-3, 0.1 pad 0.25 layers 14-16, 0.2 pad 0.25 layers 3-14)
  Top 0.203: U2.D3 v4.45,16.08
  Route3 0.203: v4.45,16.08 4.45,15.96 4.22,15.73 2.67,15.73 | v9.85,21.12
  Route3 0.381: 2.29,15.24 2.29,15.36 2.67,15.73 | 2.29,15.24 C9.1 | v9.85,21.12 9.76,21.2 8.74,21.2 7,19.46 2.68,19.46 1.7,18.48 1.7,15.84 2.29,15.24 | U7.E1 v9.85,21.12
  Route14 0.203: U7.E1 v9.85,21.12
  Bottom 0.203: C41.2 U7.E1
  other vias: 2.29,15.04 10.34,21.12 10.34,21.12
1V8  (via drill 0.1 pad 0.25 layers 1-3, 0.1 pad 0.25 layers 14-16, 0.2 pad 0.25 layers 3-14, 0.2 pad 0.41 layers 3-14)
  Top 0.203: U2.A4 4.86,17.57 5.88,18.59 C6.1 6.07,18.9 v7.39,18.9
  Route3 0.203: U7.A8 v13.14,23.06 v13.15,23.06
  Route3 0.254: U3.8 19.17,2.59 v19.35,2.77 | U7.C9 14.07,21.92 v14.13,21.86 | U7.D8 12.64,21.52 v12.61,21.55
  Route3 0.381: v8.96,15.71 8.96,15.83 7.39,17.41 v7.39,18.9 7.92,18.9 9.16,20.13 v9.16,20.64
  Route14 0.203: v13.15,23.06 13.15,22.77 | 13.15,22.77 C42.2 | 13.15,22.31 13.15,22.77 | 9.98,22.57 v9.99,22.55
  Route14 0.254: v19.35,2.77 19.52,2.6 C11.1 | v14.13,21.86 14.07,21.92 U7.C9 13.15,22.31 | v12.61,21.55 12.66,21.61 C40.2
  Route14 0.381: v8.96,15.71 v9.38,15.3 v9.38,15.29 | v9.16,20.64 9.16,22.05 9.67,22.57 9.98,22.57
  Bottom 0.203: R17.1
  Bottom 0.254: 19.52,1.66 C12.1 | C42.2 13.07,22.7 | C40.2 13.07,21.66
  Bottom 0.381: 19.52,1.66 C11.1 18,2.29 14.64,5.65 14.64,12.85 13.4,14.1 10.32,14.1 9.38,15.04 v9.38,15.29 | R17.1 10.39,23.24 10.59,23.44 12.77,23.44 13.1,23.11 C42.2 | C43.2 C40.2 | 13.07,22.7 13.07,21.66 | R17.1 v9.99,22.55
  other vias: 19.17,2.33 19.52,2.29 13.54,21.92 13.14,22.72 13.1,22.72 13.14,21.52 13.02,21.61
1V8_M  (via drill 0.1 pad 0.25 layers 1-3, 0.1 pad 0.25 layers 14-16, 0.2 pad 0.25 layers 3-14)
  Top 0.203: U2.C5 5.48,16.48 6.27,17.27 C7.1
  Top 0.381: C7.1 10.02,17.27 v10.58,16.71
  Route3 0.203: U4.5 13.49,15.46 v13.53,15.46
  Route3 0.381: v10.58,16.71 12.9,16.71 13.5,16.11 13.5,15.48 13.49,15.46 | v13.53,15.46 U4.5
  Route14 0.203: v13.53,15.46 C14.1
  Bottom 0.203: 13.13,16.41 C13.1
  Bottom 0.381: C14.1 12.91,16.19 13.13,16.41
  other vias: 12.93,15.47 12.91,15.47
3V3  (via drill 0.1 pad 0.25 layers 1-3, 0.1 pad 0.25 layers 14-16, 0.2 layers 3-14, 0.2 pad 0.25 layers 3-14)
  Top 0.203: U2.C3 4.46,16.43
  Top 0.254: U5.A3 17.2,12.07 v16.79,11.66 | U7.C1 8.62,21.92 8.18,21.47 D1.1
  Top 0.381: C8.1 4.45,13.87 5.04,13.28 8.14,13.28 v8.31,13.44 | U5.C9 21.27,17.86 C20.1 21.16,19.32 25.91,19.32 27.4,17.83 27.4,13.71 26.56,12.87 U5.J4 | U5.C1 21.27,9.12 C34.1
  Route3 0.203: U2.C3 | v4.52,15.05 4.52,14.6 C8.1 | U5.A3 v19.06,12.07 v19.05,12.06 | U7.C1 9.98,21.92 v9.94,21.95
  Route3 0.254: v5.02,16.47 U2.C3 | U5.C6 v20.93,14.82 | v20.93,14.82 | 8.31,12.99 v8.32,12.97 | v22.4,9.02 22.34,9.07 C34.1 | v16.79,11.66 16.41,11.66 v16.38,11.63 | v20.93,14.82 20.93,14.16 v20.86,14.1 | v18.86,14.24 18.79,14.31 17.35,14.31 16.5,13.47 v16.15,13.47 | v20.37,18.04 20.37,18.53 C20.1 | v6.37,21.03 5.93,21.47 D1.1
  Route3 0.381: v8.31,13.44 8.31,12.99
  Route14 0.203: v19.05,12.06 19.07,12.08 C33.1 | C39.2 10.36,21.95 v9.94,21.95
  Route14 0.254: v20.93,14.82 U5.C6 C35.1 | v20.86,14.1 19,14.1 v18.86,14.24 | 15.32,12.68 15.37,12.68 | v5.02,16.47 5.04,16.49 | 6.38,21.03 v6.37,21.03
  Route14 0.381: v5.02,16.47 4.52,15.97 v4.52,15.05 | v8.32,12.97 8.61,12.68 15.32,12.68 v16.38,11.63 16.38,10.2 17.92,8.66 22.05,8.66 v22.4,9.02 | 15.37,12.68 v16.15,13.47 16.15,16.49 17.7,18.04 v20.37,18.04 | 5.04,16.49 5.54,16.49 6.38,17.33 6.38,21.03
  other vias: 4.46,16.48 4.45,14.53 19.67,12.07 19.7,12.08 21.27,14.47 21.26,14.31 21.22,9.07 20.49,18.64 10.34,21.92 10.37,21.94 5.78,21.47
ALRT  (via drill 0.1 pad 0.25 layers 1-3, 0.1 pad 0.25 layers 14-16, 0.2 pad 0.25 layers 3-14)
  Top 0.203: v9.24,10.94 11.32,8.86 v11.32,8.83
  Route3 0.203: U1.B2 2.88,11.29 3.29,10.89 9.2,10.89 v9.24,10.94 | v11.32,8.83 11.57,8.58 18.54,8.58 19.48,9.53 24.2,9.53 24.72,10.04 24.72,11.33 25.04,11.65 26,11.65 v26.18,11.47 26.18,11.97 U5.J3
  Route14 0.203: v26.18,11.47 26.18,11.97 U5.J3
  Bottom 0.203: U5.J3 26.09,12.09 R16.2
  other vias: 2.89,11.47 26.07,12.07 26.07,12.07
B_LED  (via drill 0.1 pad 0.25 layers 1-3, 0.1 pad 0.25 layers 14-16, 0.2 pad 0.25 layers 3-14)
  Route3 0.203: U7.F5 11.94,20.14 v12.22,19.87
  Route14 0.203: v12.22,19.87 12.09,20 R8.2
  other vias: 11.94,20.72 12.09,20.3
D_N  (via drill 0.1 pad 0.25 layers 1-3)
  Top 0.203: USB1.D- 22.28,21.35 v22.27,21.34
  Route3 0.203: U7.E9 13.54,20.91 13.71,20.74 15.29,20.74 15.47,20.92 20.47,20.92 20.76,21.22 20.76,22.7 21.14,23.08 21.83,23.08 22.13,22.78 22.13,21.44 22.23,21.34 v22.27,21.34
  other vias: 13.54,21.12
D_P  (via drill 0.1 pad 0.25 layers 1-3)
  Top 0.203: 21.57,21.44 USB1.D+ 21.57,21.55 | 21.57,21.44 | 21.57,21.55 21.57,21.3 21.56,21.32 v21.62,21.32 v21.64,21.31 | 21.57,21.55 21.57,21.58
  Route3 0.203: U7.E8 13.15,20.68 13.48,20.35 15.35,20.35 15.55,20.56 20.68,20.56 21.18,21.05 21.18,22.61 21.27,22.7 21.66,22.7 21.76,22.61 21.76,21.43 v21.64,21.31
  other vias: 13.14,21.12
EN0  (via drill 0.1 pad 0.25 layers 1-3, 0.2 pad 0.25 layers 3-14)
  Route3 0.203: U2.D2 4.01,16.12 3.64,16.12 v3.62,16.14 | v23.47,16.45 23.25,16.45 U5.E8
  Route14 0.203: v3.62,16.14 4.39,16.91 4.96,16.91 5.71,17.66 5.71,22.16 7.49,23.95 14.96,23.95 16.38,22.52 16.38,20.79 17.42,19.75 22.2,19.75 23.47,18.48 v23.47,16.45
  other vias: 4.06,16.08 22.87,16.07
EN2  (via drill 0.1 pad 0.25 layers 1-3, 0.2 pad 0.25 layers 3-14)
  Top 0.203: U2.E1 v3.65,15.39
  Route3 0.203: v3.65,15.39 3.65,15.15 3.83,14.97 3.83,14.45 v3.91,14.37 | v16,18.12 19.53,18.12 20.01,17.64 22.9,17.64 U5.F9
  Route14 0.203: v3.91,14.37 3.91,14.32 4.13,14.09 5.52,14.09 9.89,18.46 13.33,18.46 13.67,18.12 v16,18.12
  other vias: 23.67,16.87
ENL  (via drill 0.1 pad 0.25 layers 1-3, 0.2 pad 0.25 layers 3-14, 0.2 pad 0.41 layers 3-14)
  Top 0.203: U2.C1 3.6,16.54 v3.17,16.54
  Route3 0.203: U5.G9 24.48,18.09 23.42,19.15 14.98,19.15 14.32,18.49 12.61,18.49 v12.26,18.84 | v2.85,16.19 2.85,16.22 v3.17,16.54
  Route14 0.203: v12.26,18.84 9.04,18.84 5.75,15.55 5.75,15.1 5.23,14.58 4.31,14.58 2.85,16.05 v2.85,16.19
  other vias: 24.47,16.87
G_LED  (via drill 0.1 pad 0.25 layers 1-3, 0.1 pad 0.25 layers 14-16, 0.2 pad 0.25 layers 3-14)
  Route3 0.203: U7.E5 11.74,21.12 v11.48,20.86
  Route14 0.203: v11.48,20.86 11.66,20.86 R9.2
  other vias: 11.94,21.12 11.92,21.13
GND  (via drill 0.1 pad 0.2 layers 1-3, 0.1 pad 0.25 layers 1-3, 0.1 pad 0.25 layers 14-16, 0.2 pad 0.36 layers 1-3, 0.2 pad 0.41)
  Top 0.203: U2.B4 U2.B5 | U2.E2 v4.06,15.38 | U1.C3 3.43,10.93 C3.2 v3.42,9.63 | U6.A3 4.64,12.37 R10.2 | USB1.SHIELD1 25.66,22.61 v25.91,22.61 | USB1.SHIELD2 17.6,22.61 v17.27,22.61 | U7.D1 10.07,21.52 v10.04,21.54
  Top 0.254: C29.2 17.41,14.53 17.11,14.53 v17.01,14.62 | Y2.2 v14.55,21.72 | U3.9 23.1,4.55 v23.11,4.57 | USB1.GND 20.32,21.48 v20.32,21.34 | USB1.SHIELD3 21.63,23.92 v21.59,23.88 | C5.2 1.99,16.13 v2.14,16.27
  Top 0.381: C6.2 5.84,19.71 5.59,19.96 v5.25,19.96
  Bottom 0.254: v23.67,16.08 23.67,16.01 C23.2 | v12.46,22.04 12.46,21.62 C40.1 C43.1
  other vias: 5.26,16.88 5.26,15.68 2.46,18.05 3.41,18.99 3.93,18.99 4.46,18.98 4.97,18.99 6.72,18.28 2.29,14.04 3.44,14.53 2.48,16.37 3.26,12.83 3.49,12.85 4.56,12.45 19.67,16.87 18.91,18.64 22.79,18.49 22.87,16.87 26.07,14.47 21.27,13.67 21.27,12.87 20.47,14.47 19.67,14.47 18.32,12.93 19.67,10.47 20.65,9.07 21.95,8.64 24.41,8.64 24.02,8.42 23.82,9.12 20.27,12.9 20.27,12.08 21.26,13.75 21.95,15.09 19.77,16.09 18.38,14.69 27.02,6.14 21.59,6.1 21.59,5.33 21.59,4.57 21.59,3.81 21.59,3.05 21.59,2.29 22.35,6.1 22.35,5.33 22.35,4.57 22.35,3.81 22.35,3.05 22.35,2.29 23.11,6.1 23.11,5.33 23.11,3.81 23.11,3.05 23.11,2.29 23.88,6.1 23.88,5.33 23.88,4.57 23.88,3.81 23.88,3.05 23.88,2.29 24.64,6.1 24.64,5.33 24.64,4.57 24.64,3.81 24.64,3.05 24.64,2.29 20.09,2.29 20.47,1.59 13.9,6.46 8.92,6.48 13.14,22.32 13.14,21.92 13.55,20.93 12.53,22.72 10.94,21.94 10.92,21.11 4.33,6.49 25.91,21.59 25.91,23.62 25.91,24.64 24.64,24.64 24.64,23.62 24.64,22.61 24.64,21.59 22.61,23.88 20.57,23.88 20.57,24.64 21.59,24.64 22.61,24.64 18.54,24.64 18.54,23.62 18.54,22.61 18.54,21.59 17.27,21.59 17.27,23.62 17.27,24.64 20.49,14.62 26.13,15.32 24.23,11.1 0.51,24.64 0.51,23.37 0.51,22.1 0.51,20.83 0.51,19.56 0.51,18.29 0.51,17.02 0.51,15.75 0.51,14.48 0.51,13.21 0.51,11.94 0.51,10.67 0.51,9.4 0.51,8.13 0.51,6.86 0.51,5.59 0.51,4.32 0.51,3.05 0.51,1.78 0.51,0.51 28.7,24.64 28.7,23.37 28.7,22.1 28.7,20.83 28.7,19.56 28.7,18.29 28.7,17.02 28.7,15.75 28.7,14.48 28.7,13.21 28.7,11.94 28.7,10.67 28.7,9.4 28.7,8.13 28.7,6.86 28.7,5.59 28.7,4.32 28.7,3.05 28.7,1.78 28.7,0.51 1.78,24.64 3.05,24.64 4.32,24.64 5.59,24.64 6.86,24.64 8.13,24.64 9.4,24.64 10.67,24.64 11.94,24.64 13.21,24.64 14.48,24.64 15.75,24.64 27.43,24.64 1.78,0.51 3.05,0.51 4.32,0.51 5.59,0.51 6.86,0.51 8.13,0.51 9.4,0.51 10.67,0.51 11.94,0.51 13.21,0.51 14.48,0.51 15.75,0.51 17.02,0.51 18.29,0.51 19.56,0.51 20.83,0.51 22.1,0.51 23.37,0.51 24.64,0.51 25.91,0.51 27.18,0.51 11.13,14.65 12.06,12.73 12.34,15.47 12.13,16.45
  pour Route2 (isolate 0.102): 0,0 0,25.15 29.21,25.15 29.21,0
  pour Route15 (isolate 0.102): 0,0 0,25.15 29.21,25.15 29.21,0
  pour Top (isolate 0.102): 0,0 0,25.15 29.21,25.15 29.21,0
  pour Route3 (isolate 0.102): 0,0 0,25.15 29.21,25.15 29.21,0
  pour Bottom (isolate 0.102): 0,0 0,25.15 29.21,25.15 29.21,0
  pour Route14 (isolate 0.102): 0,0 0,25.15 29.21,25.15 29.21,0
I2S_SCK/RV_TDI  (via drill 0.2 pad 0.36 layers 1-3, 0.2 pad 0.36 layers 3-14)
  Top 0.203: U4.4 14.2,14.65 14.78,14.08 14.78,11.64 14.78,10.03 v15.59,9.21
  Route3 0.203: U5.F2 24.07,10.87 v24.07,10.37 | v16.41,9 16.23,9.19 15.59,9.19 v15.59,9.21
  Route14 0.203: v24.07,10.37 24.07,8.96 22.89,7.77 17.63,7.77 v16.41,9
  other vias: 23.67,11.27
I2S_SDI  (via drill 0.1 pad 0.25 layers 1-3, 0.2 pad 0.36 layers 14-16, 0.2 pad 0.36 layers 3-14)
  Top 0.203: v17.18,10.21 15.44,11.96 15.44,15.87 14.29,17.02 12.58,17.02 12.01,16.45 12.01,16.22 12.01,15.49 U4.6
  Route3 0.203: v17.18,10.21 18.19,10.21 18.86,10.89 21.7,10.89 U5.D2 v22.45,11.65 v22.46,11.65
  Route14 0.203: v22.46,11.65 22.13,11.32 R12.2
  other vias: 22.07,11.27 22.07,11.32
I2S_WS/RV_TDO  (via drill 0.2 pad 0.36 layers 1-3, 0.2 pad 0.36 layers 3-14)
  Top 0.203: v11.63,10 9.83,11.8 9.83,15.1 10.2,15.47 U4.1
  Route3 0.203: U5.E2 v23.25,10.89 v23.26,10.9 | v11.63,10 11.87,9.77 v18.69,9.77
  Route14 0.203: v23.25,10.89 23.25,10.06 22.81,9.62 18.84,9.62 v18.69,9.77
  other vias: 22.87,11.27
N$1
  Top 0.203: U5.A8 19.59,16.15 18.43,16.15 C21.2 17.51,16.13 L2.2
N$2  (via drill 0.1 pad 0.25 layers 1-3, 0.1 pad 0.25 layers 14-16, 0.2 pad 0.25 layers 3-14)
  Route3 0.203: U2.B2 4.06,17.27 v4.09,17.31
  Route14 0.203: v4.09,17.31 3.47,17.31 v2.92,16.77
  Bottom 0.203: R3.2 3.03,16.38 3.03,16.66 v2.92,16.77
  other vias: 4.06,16.88
N$3  (via drill 0.1 pad 0.25 layers 1-3)
  Top 0.203: U2.B3
  Route3 0.203: U2.B3 4.48,16.9 4.48,17.93 R4.2
  other vias: 4.46,16.88 4.97,18.42
N$4  (via drill 0.1 pad 0.25 layers 1-3)
  Top 0.203: U2.C2 v4.06,16.47
  Route3 0.203: v4.06,16.47 4.01,16.52 3.71,16.52 3.27,16.96 3.27,18.05 3.64,18.42 R5.2
  other vias: 3.93,18.42
N$5
  Top 0.203: U2.A2 4.06,17.41 3.41,18.05 R1.2
N$6
  Top 0.203: U2.A3 R2.2
N$7
  Top 0.203: U2.D5 5.92,16.08 6.25,16.41 C10.1
N$8
  Top 0.203: U2.E4 4.86,15.35 5.14,15.06 5.14,14.62 L1.1
N$9  (via drill 0.1 pad 0.25 layers 1-3)
  Route3 0.203: U5.C8 21.27,16.78 20.82,17.24 18.95,17.24 C21.1
  other vias: 21.27,16.07 18.41,16.7
N$10
  Top 0.203: Y1.3 19.6,13.6 U5.A5
N$11  (via drill 0.1 pad 0.25 layers 1-3)
  Route3 0.203: U5.B5 17.89,13.67 17.5,13.28 Y1.1
  other vias: 20.47,13.67 17.5,12.93
N$12
  Top 0.203: U1.C2 2.89,10.24 C3.1
N$13
  Top 0.203: U5.B9 20.48,17.33 20.11,17.69 17.96,17.69 17.46,18.19 L2.1
N$14
  Top 0.203: U7.A9 13.88,23.06 Y2.1
N$15  (via drill 0.1 pad 0.25 layers 1-3)
  Route3 0.203: U7.B9 13.58,22.36 15.1,22.36 Y2.3
  other vias: 15.22,22.24 13.54,22.32
N$16  (via drill 0.1 pad 0.25 layers 1-3, 0.1 pad 0.25 layers 14-16, 0.2 pad 0.25 layers 3-14)
  Route3 0.203: U7.D9 13.88,21.52 v14.08,21.32
  Route14 0.203: v14.08,21.32 13.9,21.5 C44.1
  other vias: 13.54,21.52 13.55,21.5
N$17  (via drill 0.2 pad 0.41)
  Bottom 0.254: R7.1 9.45,19.72 8.28,20.89 5.51,20.89 D1.2
  other vias: 4.93,21.47
N$18  (via drill 0.2 pad 0.41)
  Bottom 0.254: R8.1 12.09,19.25 11.95,19.12 9.12,19.12 7.83,20.41 4.43,20.41 4.07,20.78 4.07,21.46 D1.3
  other vias: 4.93,22.32
N$19  (via drill 0.1 pad 0.25 layers 1-3, 0.1 pad 0.25 layers 14-16, 0.2 pad 0.25 layers 3-14)
  Route3 0.254: v6.86,22.32 D1.4
  Route14 0.254: v11.89,22.3 11.89,22.71 11.28,23.32 8.96,23.32 7.96,22.32 v6.86,22.32
  Bottom 0.254: R9.1 11.89,21.73 v11.89,22.3
  other vias: 5.78,22.32
N$20  (via drill 0.1 pad 0.25 layers 1-3)
  Top 0.254: L3.2 6.43,12.44 v6.43,12.49
  Route3 0.203: U6.A2 4.64,11.72 5.37,12.45 6.4,12.45 v6.43,12.49
  other vias: 4.64,11.25
N$22
  Top 0.203: U6.B3 5.04,12.36 R10.1
N$31  (via drill 0.1 pad 0.25 layers 1-3)
  Top 0.203: U2.C4 U2.D4 | C10.2 6.73,14.3 L1.2
  Route3 0.203: U2.D4 5.87,16.08 6.55,15.4 C10.2
  other vias: 4.86,16.08 6.73,15.4
P0_0_UART0_RX  (via drill 0.1 pad 0.25 layers 1-3)
  Top 0.203: U5.J9 R11.2
  Route3 0.203: U7.F6 12.34,20.33 13.09,19.59 24.66,19.59 R11.2
  other vias: 12.34,20.72 26.07,18.18
P0_1_UART0_TX  (via drill 0.1 pad 0.25 layers 1-3, 0.2 pad 0.25 layers 3-14)
  Route3 0.203: 12.37,21.09 | 12.37,21.09 U7.E6 12.5,21.12 12.83,20.79 12.83,20.36 13.26,19.94 23.99,19.94 v24.14,20.09 | v25,17.86 25,17.15 U5.H9
  Route14 0.203: v24.14,20.09 25,19.24 v25,17.86
  other vias: 12.34,21.12 25.27,16.87
P2.7
  Top 0.203: U7.G5 11.94,19.65 11.63,19.34 7.64,19.34 6.3,20.69 2.96,20.69 1.46,19.19 1.46,10.9 4.73,7.63 10.72,7.63 11.07,7.29 SW2.1
QSPI0_SDIO2  (via drill 0.1 pad 0.25 layers 1-3, 0.2 pad 0.25 layers 3-14, 0.2 pad 0.41 layers 3-14)
  Route3 0.203: U3.3 26.18,5.72 v26.18,6.54 | v24.86,14.1 24.84,14.1 U5.G6
  Route14 0.203: v26.18,6.54 26.18,10.73 26.61,11.17 26.61,13.24 25.83,14.02 24.95,14.02 v24.87,14.1 v24.86,14.1
  other vias: 27.02,4.87 24.47,14.47
QSPI0_SDIO3  (via drill 0.1 pad 0.25 layers 1-3, 0.2 pad 0.25 layers 3-14)
  Route3 0.203: U3.7 20.2,4.63 20.2,5.8 21.01,6.61 25.67,6.61 v26.56,7.5 | v24.06,14.07 23.68,14.46 U5.F6
  Route14 0.203: v26.56,7.5 27.2,8.14 27.2,13.67 25.94,14.93 24.54,14.93 24.06,14.45 v24.06,14.07
  other vias: 19.17,3.6 23.67,14.47
R_LED  (via drill 0.1 pad 0.25 layers 1-3, 0.1 pad 0.25 layers 14-16, 0.2 pad 0.25 layers 3-14)
  Route3 0.203: v11.57,19.83 11.54,19.86 U7.G4
  Route14 0.203: R7.2 11.57,20.27 v11.57,19.83
  other vias: 11.56,20.29 11.54,20.32
RST_N  (via drill 0.1 pad 0.25 layers 1-3, 0.1 pad 0.25 layers 14-16, 0.2 pad 0.25 layers 3-14)
  Route3 0.203: v10.95,22.9 11.03,22.9 11.14,22.79 U7.B3 11.1,22.36 8.69,22.36 6.71,20.38 2.2,20.38 1.15,19.33 1.15,10.87 4.63,7.39 5.93,7.39 6.47,6.84 SW3.1
  Route14 0.203: v10.95,22.9 10.95,22.57 R17.2
  other vias: 11.14,22.32 10.96,22.56 6.48,6.49
RSTN  (via drill 0.1 pad 0.25 layers 1-3, 0.1 pad 0.25 layers 14-16, 0.2 pad 0.25 layers 3-14, 0.2 pad 0.41)
  Top 0.203: U7.G8 13.14,19.38 14.19,18.33 15.01,18.33 16.21,17.14 16.21,13 16.43,12.78 v16.61,12.78
  Top 0.254: SW1.1 | SW1.1 v16.05,6.51
  Route3 0.203: U5.B4 v20.78,13.17 | v20.78,13.17 | v16.61,12.78 16.87,12.53 17.72,12.53 17.89,12.7 17.89,12.98 18.17,13.26 20.69,13.26 v20.78,13.17
  Route14 0.203: v20.78,13.17 20.94,13.01 R6.2
  Bottom 0.254: v16.05,6.51 18.85,9.31 19.44,9.31 20.94,10.81 R6.2
  other vias: 20.47,12.87 20.94,12.86
SCL  (via drill 0.1 pad 0.25 layers 1-3, 0.1 pad 0.25 layers 14-16, 0.2 pad 0.25 layers 3-14)
  Route3 0.203: U1.B1 2.03,11.47 1.88,11.32 1.88,10.74 2.54,10.07 8.88,10.07 9.88,11.08 17.83,11.08 18.43,11.68 21.16,11.68 22.44,12.96 v22.44,13.42 22.2,13.67 U5.D5
  Route14 0.203: v22.44,13.42 22.38,13.42 R14.2
  other vias: 2.49,11.47 22.08,13.73 22.07,13.67
SD_SPI_DI  (via drill 0.1 pad 0.25 layers 1-3)
  Route3 0.203: U3.5 20.13,7.1 25.02,7.1 27.26,9.34 27.26,14.03 26.02,15.27 U5.H7
  other vias: 19.17,6.14 25.27,15.27
SD_SPI_DO  (via drill 0.1 pad 0.25 layers 1-3)
  Route3 0.203: U3.2 27.02,4.15 27.69,4.82 27.69,14.36 26.37,15.69 24.89,15.69 U5.G7
  other vias: 27.02,3.6 24.47,15.27
SD_SPI_SCLK  (via drill 0.1 pad 0.25 layers 1-3)
  Top 0.203: U3.6 18.47,4.87 18.15,5.19 18.15,6.56 18.81,7.22 24.32,7.22 v25.06,7.95
  Route3 0.203: v25.06,7.95 26.8,9.69 26.8,12.95 U5.H6
  other vias: 25.27,14.47
SDA  (via drill 0.1 pad 0.25 layers 1-3, 0.1 pad 0.25 layers 14-16, 0.2 pad 0.25 layers 3-14)
  Top 0.203: v8.52,10.46 9.43,9.56 v9.86,9.56
  Route3 0.203: U1.C1 3.08,10.48 8.51,10.48 v8.52,10.46 | U5.H4 25.17,12.76 v25.17,12.14 24.95,12.37 22.41,12.37 21.33,11.28 18.74,11.28 18.07,10.61 10.92,10.61 v9.86,9.56
  Route14 0.203: v25.17,12.14 25.26,12.23 R15.2
  other vias: 2.49,11.07 25.26,12.93 25.27,12.87
SRAM_CS  (via drill 0.1 pad 0.25 layers 1-3, 0.2 pad 0.25 layers 3-14)
  Route3 0.203: U3.1 26.23,3.12 v26.23,4.44 | v23.28,14.11 22.92,14.47 U5.E6
  Route14 0.203: v26.23,4.44 26.23,5.71 27.78,7.25 27.78,14.36 26.46,15.68 24.34,15.68 23.28,14.62 v23.28,14.11
  other vias: 27.02,2.33 22.87,14.47
SWDCLK  (via drill 0.1 pad 0.25 layers 1-3)
  Top 0.203: U5.J1 26.72,10.47 28.21,11.95 28.21,18.41 26.62,20 14.96,20 v14.19,19.22 | v12.85,18.93 12.34,19.43 U7.G6
  Route3 0.203: v14.19,19.22 13.89,18.93 v12.85,18.93
SWDIO  (via drill 0.1 pad 0.25 layers 1-3, 0.2 pad 0.25 layers 3-14)
  Route3 0.203: U5.H2 25.68,10.86 v25.72,10.86 | v12.08,21.89 12.08,21.65 U7.D5
  Route14 0.203: v25.72,10.86 25.72,12.22 26.03,12.53 26.03,12.92 25.37,13.57 23.1,13.57 22.39,14.29 22.39,14.81 23.07,15.5 23.07,16.48 20.97,18.59 14.28,18.59 12.26,20.6 12.26,21.3 12.08,21.49 v12.08,21.89
  other vias: 25.27,11.27 11.94,21.52
VBAT  (via drill 0.1 pad 0.25 layers 1-3, 0.2 pad 0.25 layers 3-14)
  Top 0.203: U2.A1 U2.B1 2.61,16.89 C4.1 2.55,16.95 C5.1 2.62,15.8 | 2.62,15.8 2.9,16.08 U2.D1 | 2.62,15.8 3.37,15.05 4.24,15.05 4.46,15.27 U2.E3 4.46,15.55 v4.5,15.51 | U1.B3 3.66,11.47 4.29,10.85 U6.A1
  Route3 0.203: U2.A5 5.01,17.28 v4.89,17.4 | v3.93,17.8 3.9,17.8 3.66,17.56 U2.A1
  Route3 0.254: U1.B3 3.89,12.07 3.89,13.16 4.99,14.26 4.99,15.36 4.81,15.54 4.53,15.54 v4.5,15.51
  Route14 0.203: v4.89,17.4 4.56,17.4 4.16,17.8 v3.93,17.8
  other vias: 5.26,17.28 3.66,17.28 3.29,11.47
VCORE_A  (via drill 0.1 pad 0.25 layers 1-3, 0.1 pad 0.25 layers 14-16, 0.2 pad 0.25 layers 3-14)
  Top 0.203: U6.B2 5.54,11.25 | 6.19,10.6 L3.1 | 23.03,8.44 C25.1
  Top 0.254: 22.4,8.21 22.62,8.44
  Top 0.381: 6.19,10.6 5.54,11.25 | U5.E1 23.25,10.1 C28.1 23.25,8.65 23.03,8.44 22.62,8.44 | U5.D9 22.07,18.19 C27.1 | L3.1 8.74,8.33 18.84,8.33 18.95,8.21 22.4,8.21
  Route3 0.203: C25.1 22.94,8.35 v22.54,8.35
  Route3 0.254: U5.E1 22.86,10.46 v22.51,10.46 | v22.45,16.49 U5.D9 | U5.B7 20.23,15.02 v19.98,15.02
  Route14 0.203: v22.54,8.35 22.82,8.64 C24.1
  Route14 0.254: v19.97,15.02 v19.98,15.02 | v22.45,16.49 v22.44,16.5 | C26.1
  Route14 0.381: v22.51,10.46 22.23,10.74 18.13,10.74 17.05,11.82 17.05,13.12 18.94,15.02 v19.97,15.02 | v22.44,16.5 21.8,16.5 C26.1 | C26.1 20.33,15.02 v19.98,15.02
  other vias: 23.02,8.42 22.84,8.64 22.87,10.47 22.07,16.87 20.47,15.27 20.49,15.19
VIN  (via drill 0.1 pad 0.25 layers 1-3, 0.1 pad 0.25 layers 14-16, 0.2 pad 0.25 layers 3-14)
  Top 0.203: U1.A2 U1.A1 v2.49,12.63 C2.1
  Route3 0.203: v2.49,12.63 2.28,12.83 v2,12.83
  Route14 0.203: v2,12.83 2.46,12.83 C1.1
  other vias: 2.48,12.85
VREGO_A  (via drill 0.1 pad 0.25 layers 1-3, 0.1 pad 0.25 layers 14-16, 0.2 pad 0.25 layers 3-14)
  Top 0.203: U5.D1 22.07,9.33 C38.1 | 26.71,16.57 v26.73,16.59
  Top 0.381: U5.J5 26.71,14.31 26.71,16.57
  Route3 0.203: U5.A4 19.65,12.84 v19.31,12.84 | U5.B8 v20.86,16.45 | U5.C7 21.77,14.77 v21.77,14.54 | v26.73,16.59 26.73,16.9 v25.85,17.78 25.85,17.84 R11.1
  Route3 0.254: U5.D1 22.07,10.17 v21.91,10 | U7.A4 11.54,21.51 11.06,21.03 11.06,19.32 12.42,17.95 15,17.95 16.7,16.25 20.29,16.25 U5.B8
  Route14 0.203: v19.31,12.84 19.36,12.9 C37.1 | v20.86,16.45 20.7,16.45 C32.1 | v21.38,14.99 21.77,14.6 v21.77,14.54
  Route14 0.254: v22.52,9.98 22.49,10 v21.91,10 | v25.51,17.48 25.55,17.48 v25.85,17.78
  Bottom 0.254: v21.38,14.99 C36.1 | 20.38,16.09 C32.1 | 19.79,13.53 19.7,13.44 | 19.72,13.53 19.72,12.91 C37.1 | C37.1 | C37.1 U5.A4
  Bottom 0.305: R6.1 21.51,13.2 21.39,13.32 20.6,13.32 20.39,13.53 19.79,13.53 19.72,13.53
  Bottom 0.381: R15.1 25.79,13.5 | 25.79,13.5 26.12,13.17 R16.1 26.9,12.65 27.31,12.24 27.31,10.47 26.41,9.57 22.92,9.57 v22.52,9.98 | R15.1 24.46,14.3 | 24.46,14.3 R14.1 22.01,14.3 21.38,14.93 v21.38,14.99 | C36.1 20.38,16.09 | C32.1 20.34,16.5 20.16,16.68 19.25,16.68 19.25,14 19.72,13.53 | 24.46,14.3 25.51,15.35 v25.51,17.48 | R15.1 25.07,13.5 C22.1 | 25.79,13.5 26.13,13.85 C31.1
  other vias: 20.34,16.09 19.67,12.87 19.7,12.9 20.47,16.07 22.07,10.47 21.27,15.27 25.5,18.18 11.54,22.72
VREGO_B  (via drill 0.1 pad 0.25 layers 1-3, 0.1 pad 0.25 layers 14-16, 0.2 pad 0.25 layers 3-14, 0.2 pad 0.41)
  Top 0.203: U5.A7 C30.1 17.7,15.26 C29.1 17.53,15.32 v16.94,15.32
  Route3 0.203: U5.D8 22.44,15.7 v22.46,15.7
  Route14 0.203: v22.46,15.7 22.4,15.7 C23.1
  Bottom 0.254: 22.13,16.01 C23.1
  Bottom 0.381: v16.94,15.32 16.92,15.34 16.92,15.58 18.91,17.57 20.58,17.57 22.13,16.01
  other vias: 22.07,16.07 22.13,15.98